# EAGLE schematic GPU (EAGLE 9.4.2)
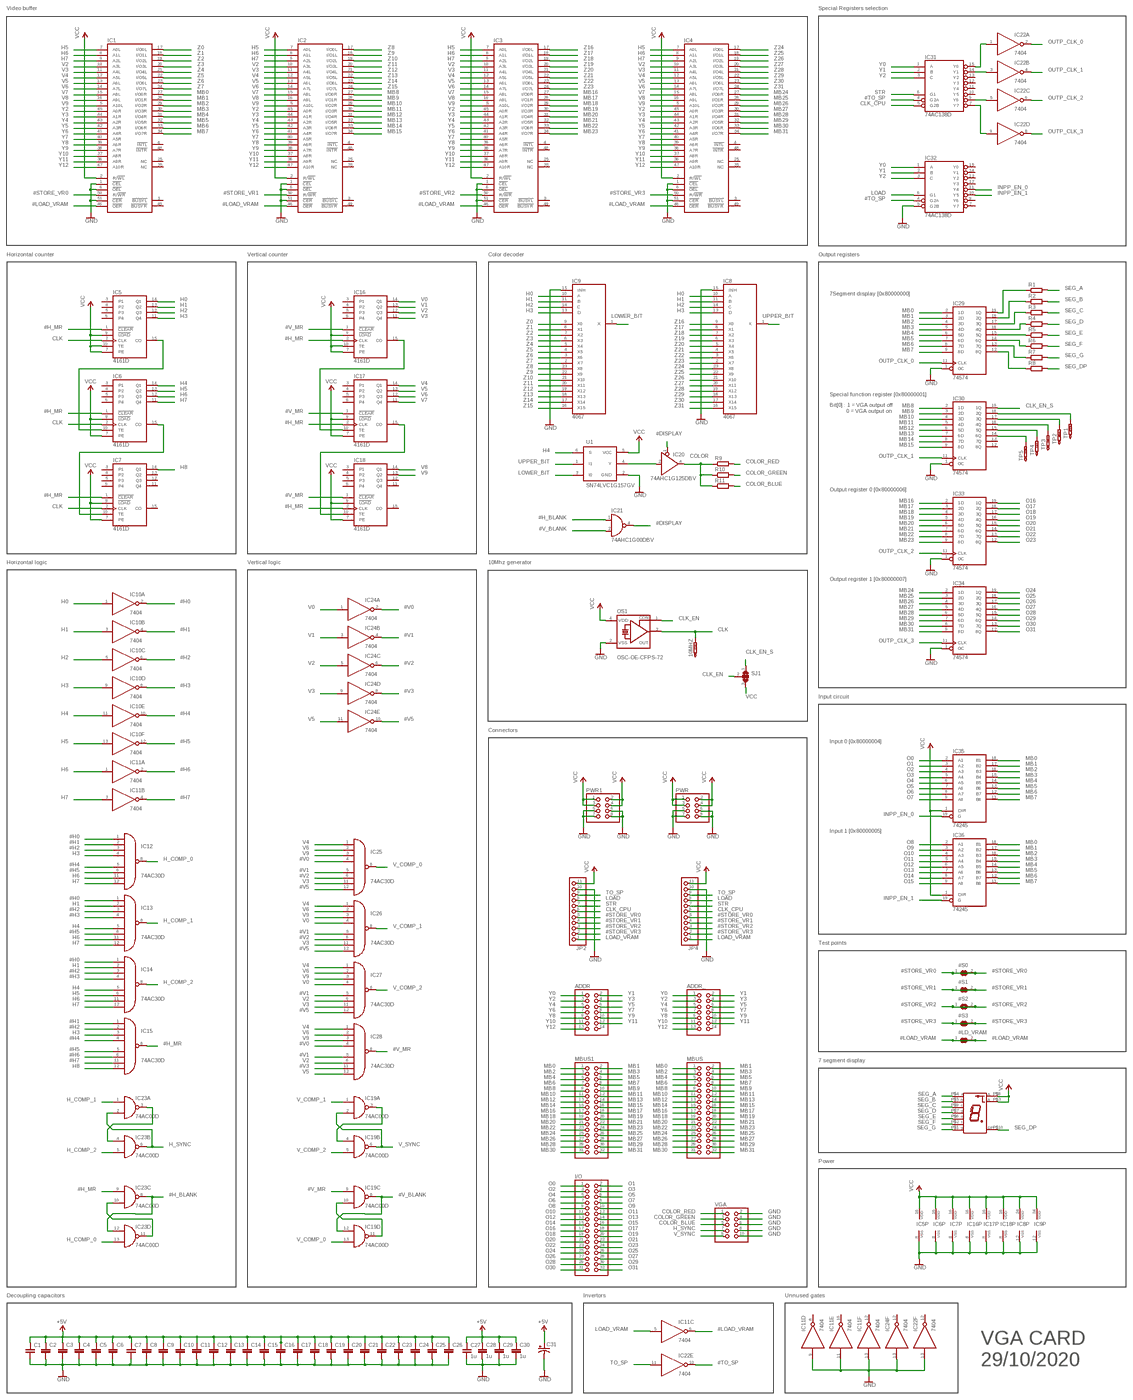
[diagram p0: schematic, sheet 1, overview]
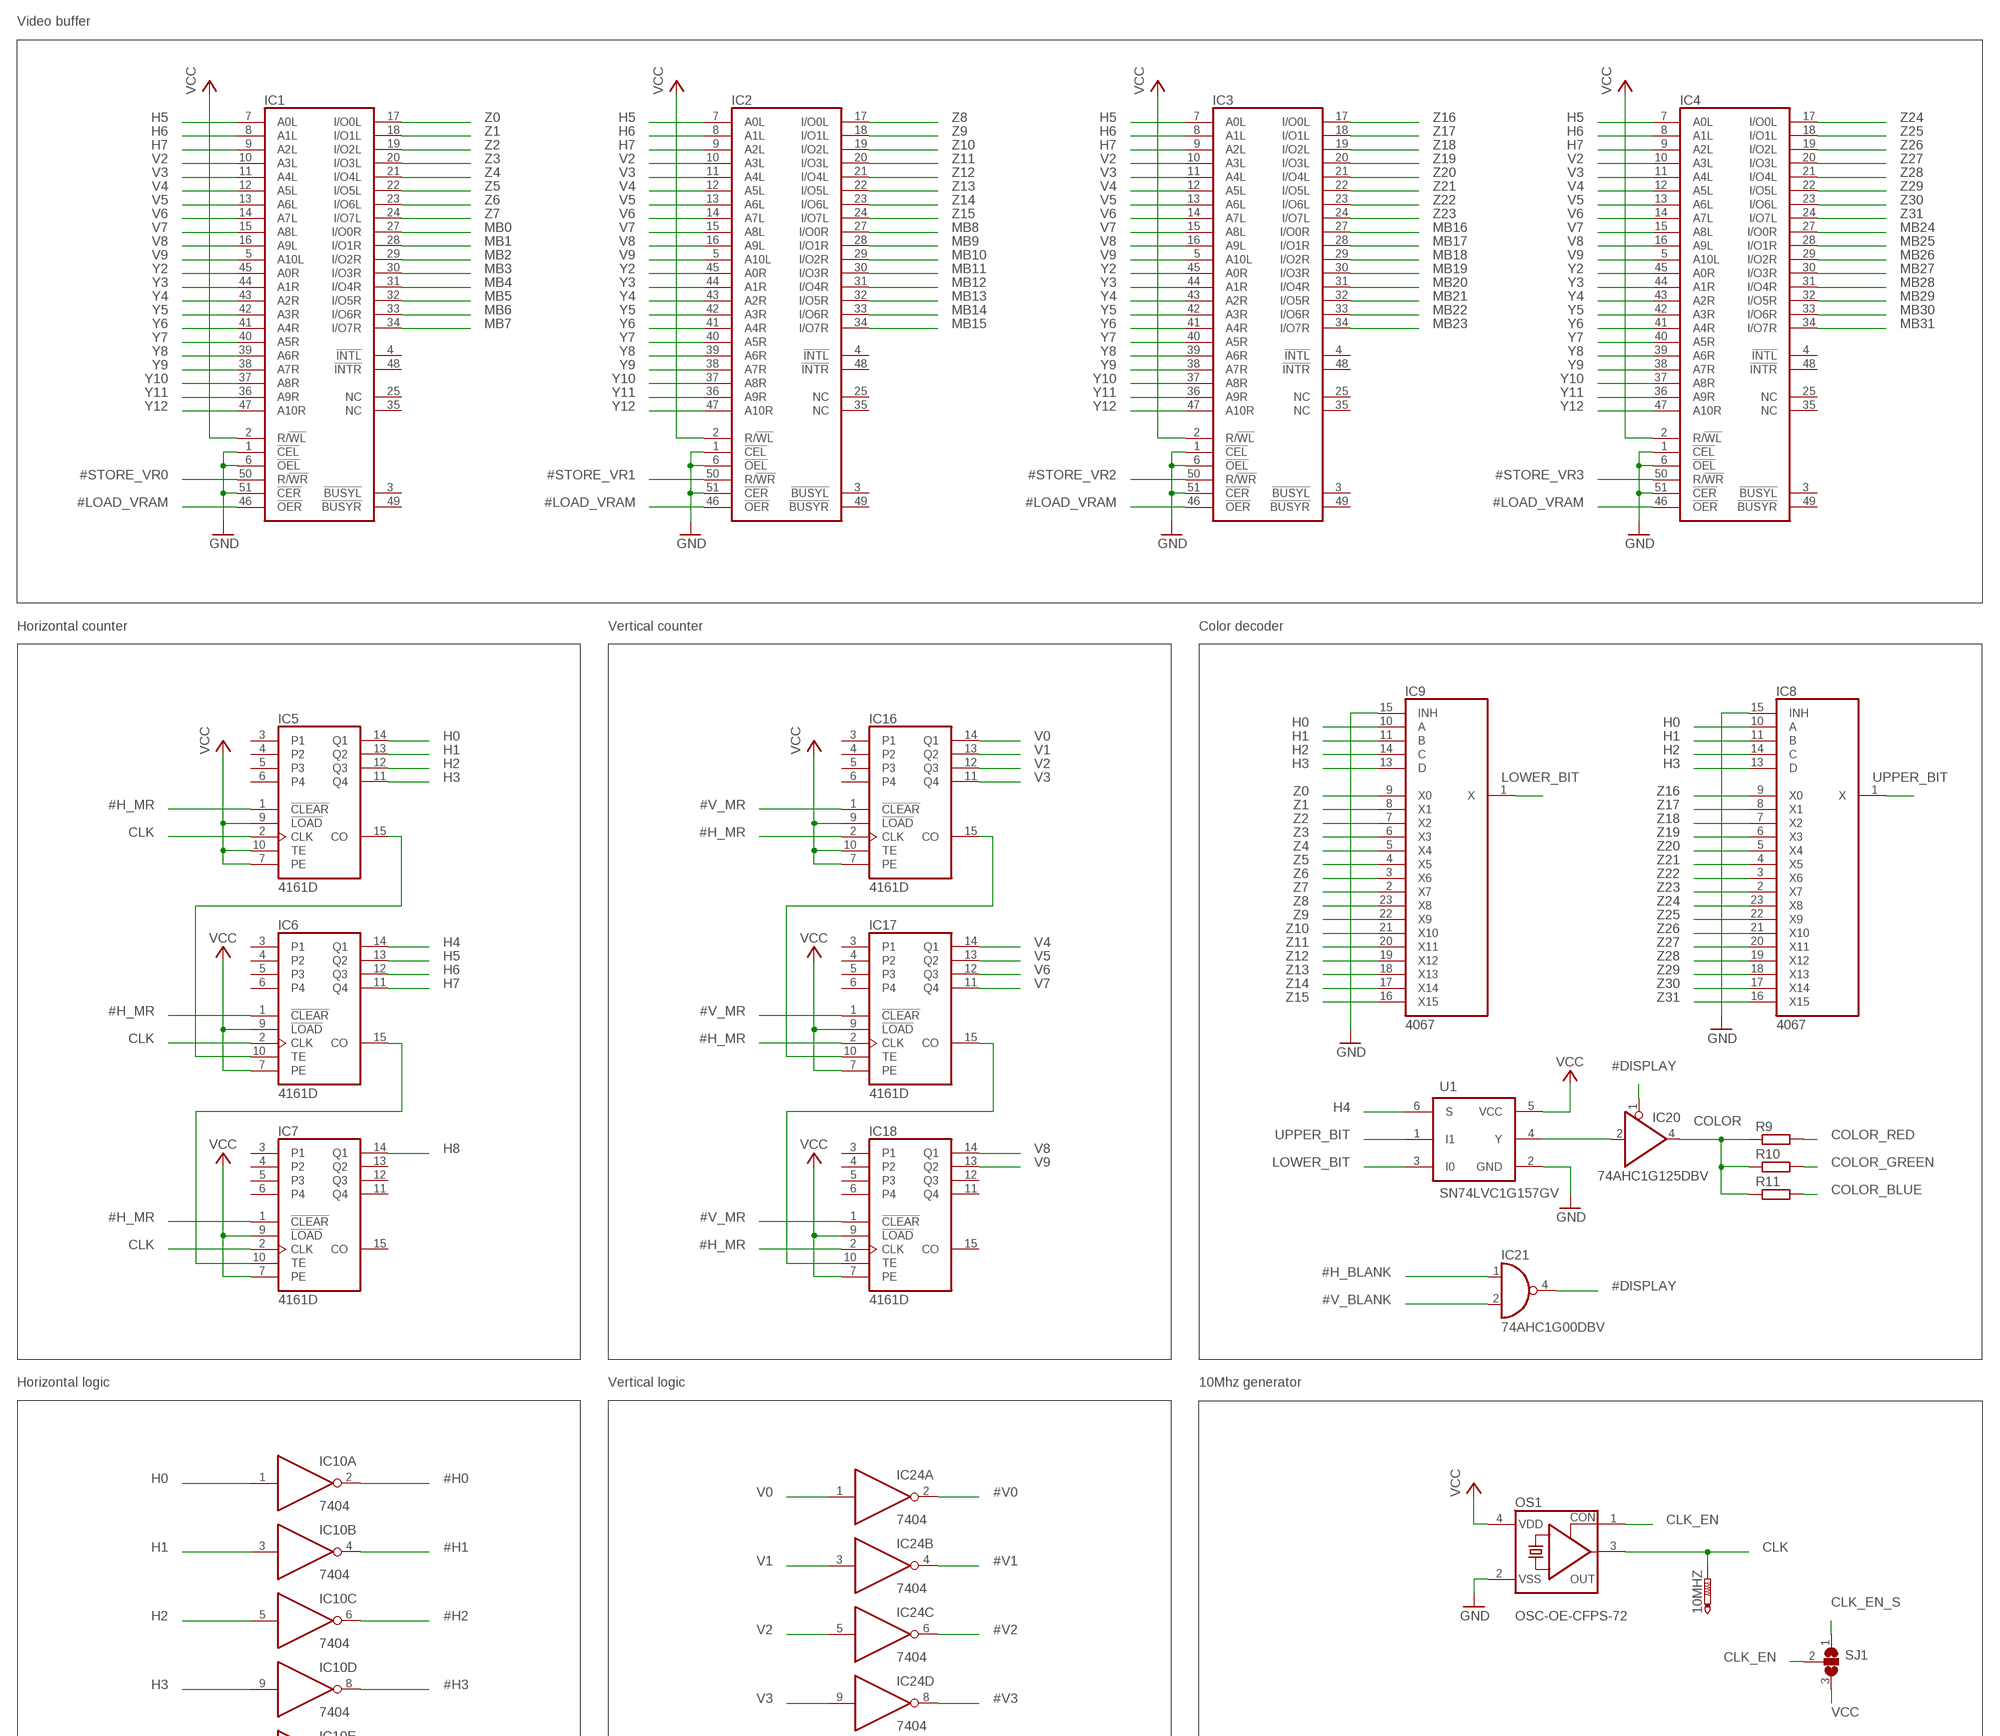
[diagram p1: schematic, sheet 1, part 1 of 4]
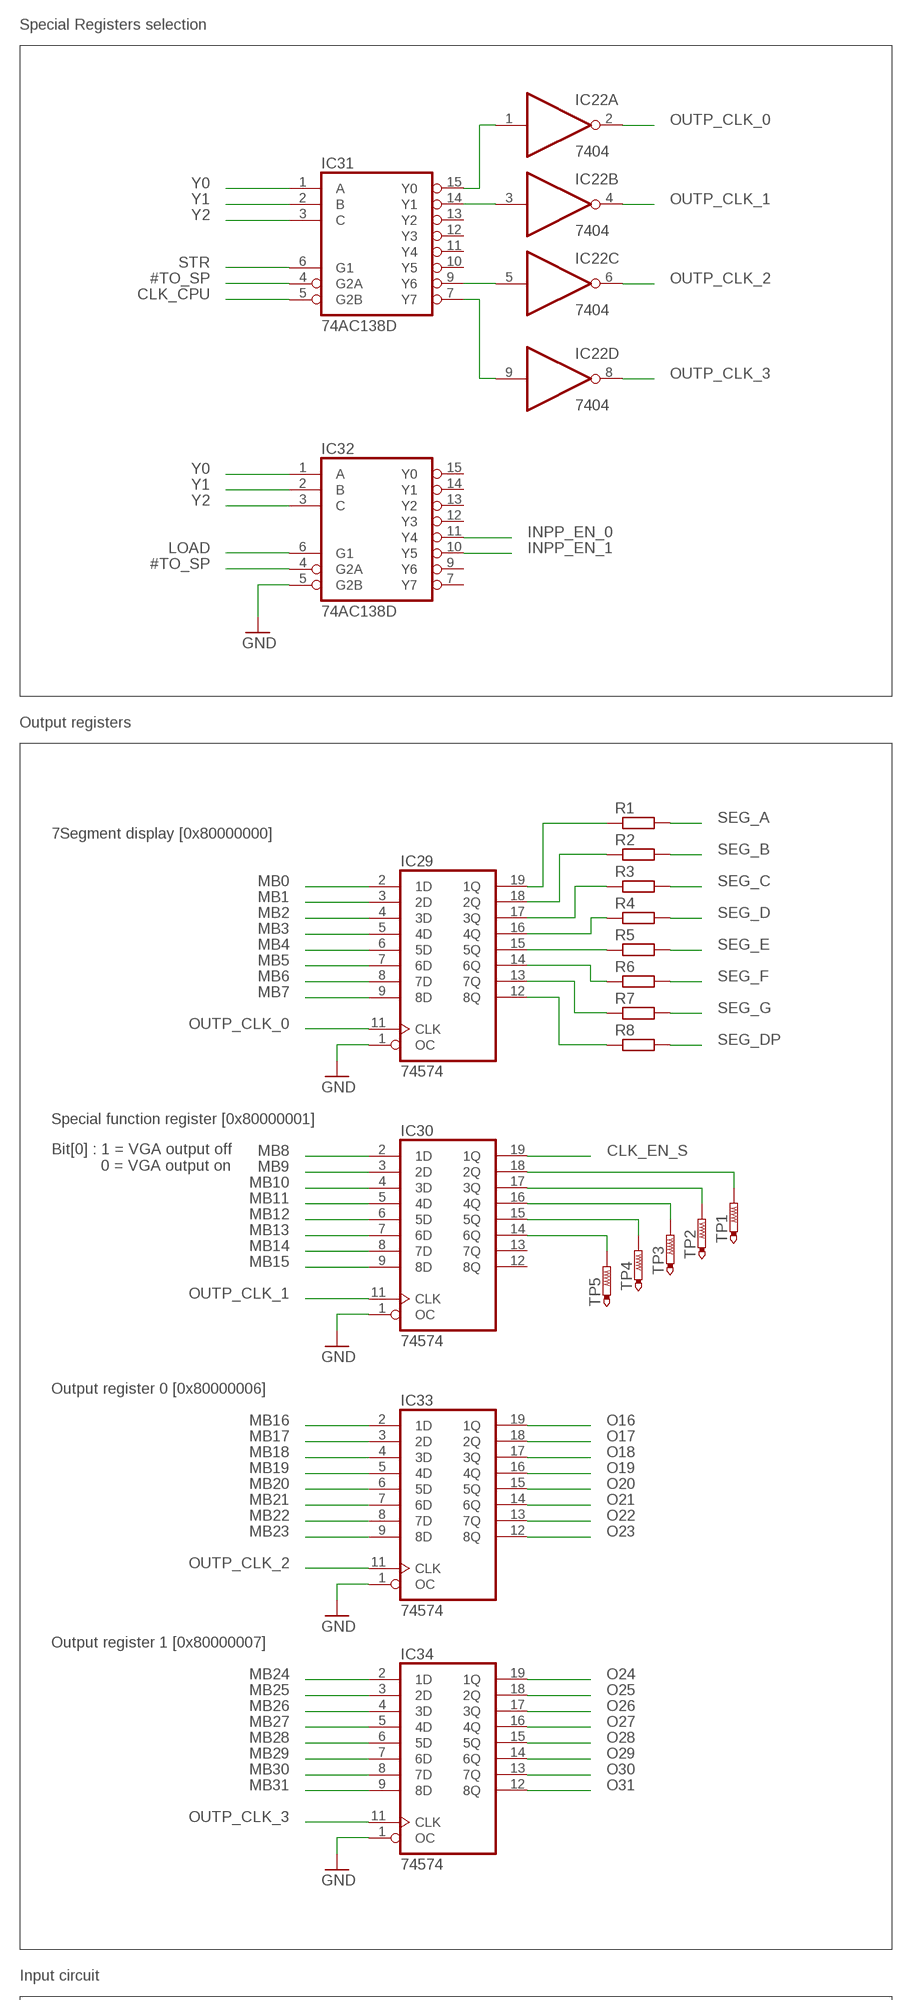
[diagram p2: schematic, sheet 1, part 2 of 4]
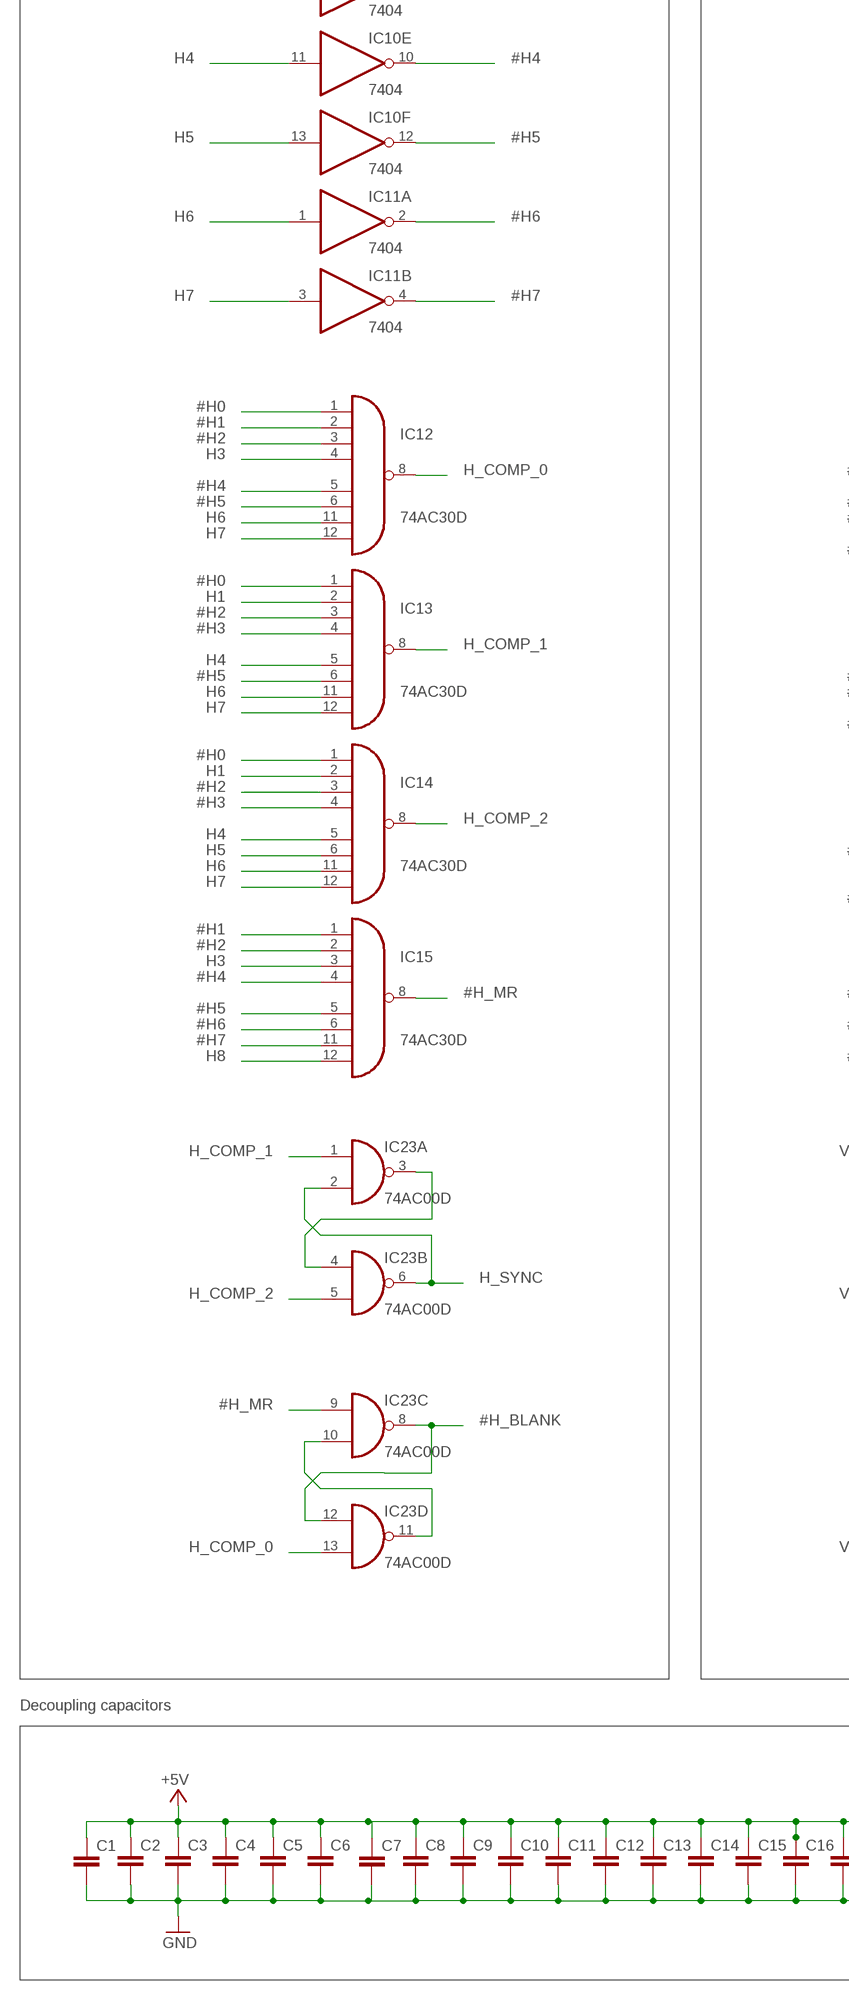
[diagram p3: schematic, sheet 1, part 3 of 4]
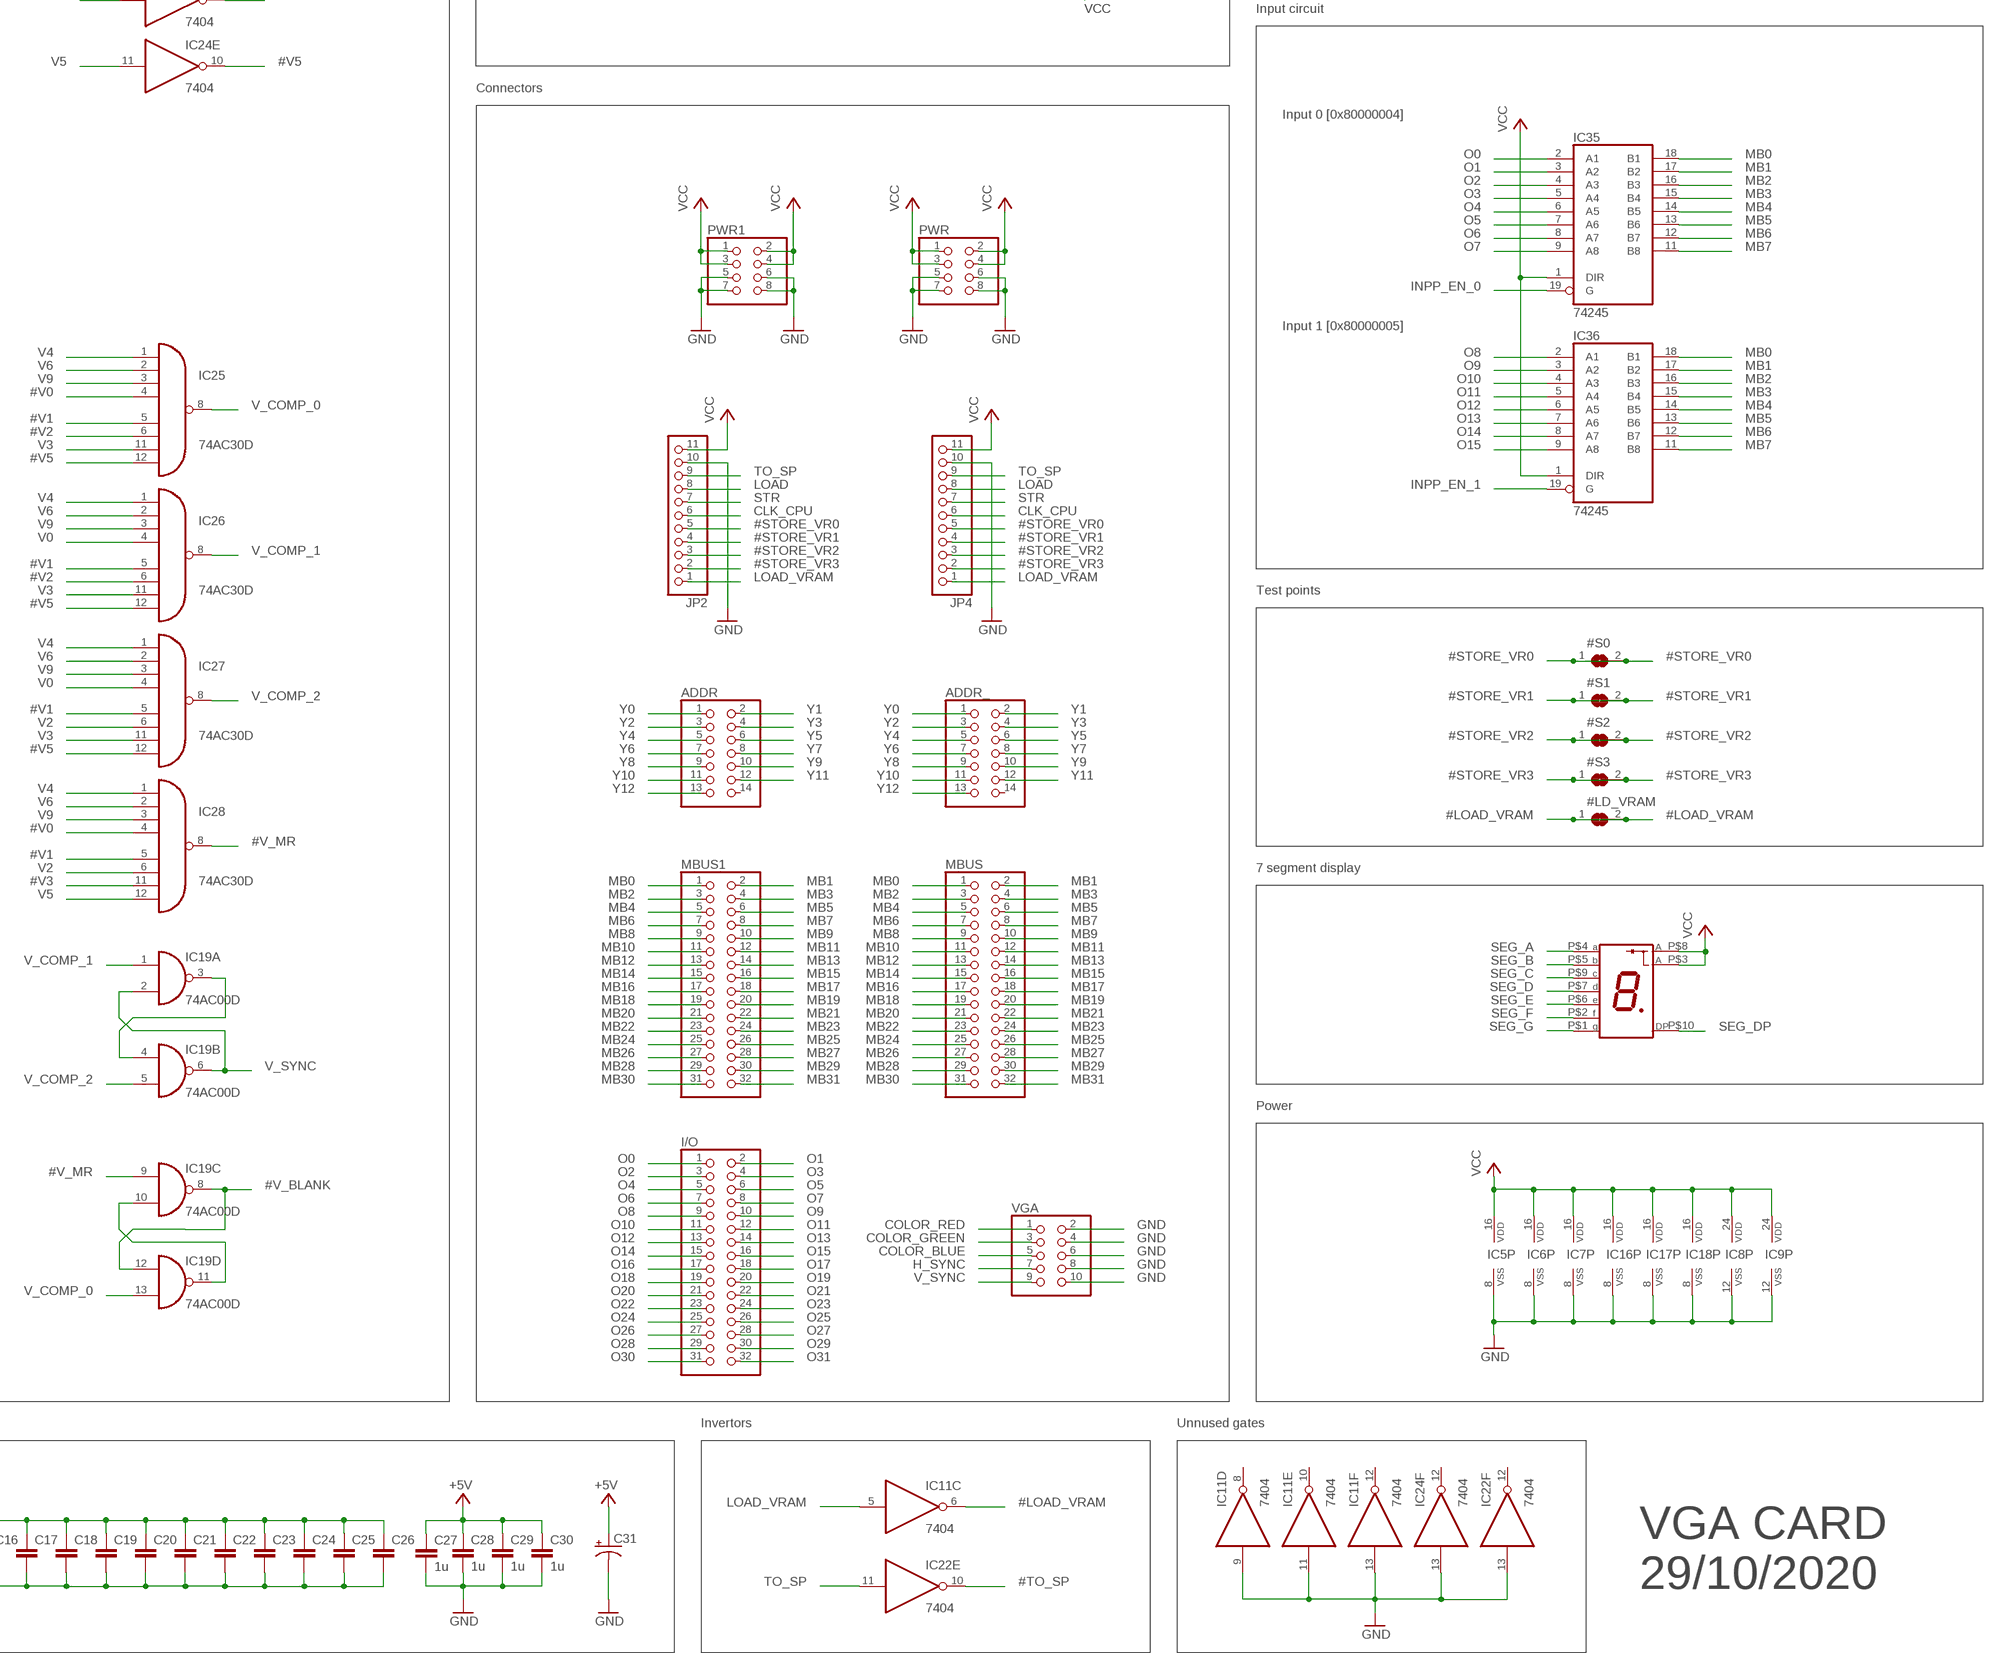
[diagram p4: schematic, sheet 1, part 4 of 4]

## Parts
10MHZ  PTR1B2,54  [B2,54]
#LD_VRAM  SJ  [SJ]
#S0  SJ  [SJ]
#S1  SJ  [SJ]
#S2  SJ  [SJ]
#S3  SJ  [SJ]
ADDR  PINHD-2X7  [2X07]
ADDR_  PINHD-2X7  [2X07]
C1  C-EUC0805  [C0805]
C2  C-EUC0805  [C0805]
C3  C-EUC0805  [C0805]
C4  C-EUC0805  [C0805]
C5  C-EUC0805  [C0805]
C6  C-EUC0805  [C0805]
C7  C-EUC0805  [C0805]
C8  C-EUC0805  [C0805]
C9  C-EUC0805  [C0805]
C10  C-EUC0805  [C0805]
C11  C-EUC0805  [C0805]
C12  C-EUC0805  [C0805]
C13  C-EUC0805  [C0805]
C14  C-EUC0805  [C0805]
C15  C-EUC0805  [C0805]
C16  C-EUC0805  [C0805]
C17  C-EUC0805  [C0805]
C18  C-EUC0805  [C0805]
C19  C-EUC0805  [C0805]
C20  C-EUC0805  [C0805]
C21  C-EUC0805  [C0805]
C22  C-EUC0805  [C0805]
C23  C-EUC0805  [C0805]
C24  C-EUC0805  [C0805]
C25  C-EUC0805  [C0805]
C26  C-EUC0805  [C0805]
C27  1u  C-EUC0805  [C0805]
C28  1u  C-EUC0805  [C0805]
C29  1u  C-EUC0805  [C0805]
C30  1u  C-EUC0805  [C0805]
C31  CAPACITOR-P153CLV-1010  [153CLV-1010]
I/O  PINHD-2X16  [2X16]
IC1  71321L  [L52-1]
IC2  71321L  [L52-1]
IC3  71321L  [L52-1]
IC4  71321L  [L52-1]
IC5  4161D  [SO16]
IC6  4161D  [SO16]
IC7  4161D  [SO16]
IC8  4067  [TSSOP24]
IC9  4067  [TSSOP24]
IC10  7404  [TSSOP14]
IC11  7404  [TSSOP14]
IC12  74AC30D  [SO14]
IC13  74AC30D  [SO14]
IC14  74AC30D  [SO14]
IC15  74AC30D  [SO14]
IC16  4161D  [SO16]
IC17  4161D  [SO16]
IC18  4161D  [SO16]
IC19  74AC00D  [SO14]
IC20  74AHC1G125DBV  [SOT23-5]
IC21  74AHC1G00DBV  [SOT23-5]
IC22  7404  [TSSOP14]
IC23  74AC00D  [SO14]
IC24  7404  [TSSOP14]
IC25  74AC30D  [SO14]
IC26  74AC30D  [SO14]
IC27  74AC30D  [SO14]
IC28  74AC30D  [SO14]
IC29  74574  [TSSOP20]
IC30  74574  [TSSOP20]
IC31  74AC138D  [SO16]
IC32  74AC138D  [SO16]
IC33  74574  [TSSOP20]
IC34  74574  [TSSOP20]
IC35  74245  [TSSOP20]
IC36  74245  [TSSOP20]
JP2  PINHD-1X11  [1X11]
JP4  PINHD-1X11  [1X11]
MBUS  PINHD-2X16  [2X16]
MBUS1  PINHD-2X16  [2X16]
OS1  OSC-OE-CFPS-72  [7.2X5.2-4-PAD]
PWR  PINHD-2X4  [2X04]
PWR1  PINHD-2X4  [2X04]
R1  R-EU_R0805  [R0805]
R2  R-EU_R0805  [R0805]
R3  R-EU_R0805  [R0805]
R4  R-EU_R0805  [R0805]
R5  R-EU_R0805  [R0805]
R6  R-EU_R0805  [R0805]
R7  R-EU_R0805  [R0805]
R8  R-EU_R0805  [R0805]
R9  R-EU_R0805  [R0805]
R10  R-EU_R0805  [R0805]
R11  R-EU_R0805  [R0805]
SJ1  SJ2W  [SJ_2]
TP1  PTR1B1,27  [B1,27]
TP2  PTR1B1,27  [B1,27]
TP3  PTR1B1,27  [B1,27]
TP4  PTR1B1,27  [B1,27]
TP5  PTR1B1,27  [B1,27]
U1  SN74LVC1G157GV  [SOT457]
U$1  OPS-S5621YG  [OPS-S5621YG]
VGA  PINHD-2X5  [2X05]

## Nets
#DISPLAY: IC20.1(OE) IC21.4(O)
#H0: IC10.2(A:O) IC12.1(I0) IC13.1(I0) IC14.1(I0)
#H1: IC10.4(B:O) IC12.2(I1) IC15.1(I0)
#H2: IC10.6(C:O) IC12.3(I2) IC13.3(I2) IC14.3(I2) IC15.2(I1)
#H3: IC10.8(D:O) IC13.4(I3) IC14.4(I3)
#H4: IC10.10(E:O) IC12.5(I4) IC15.4(I3)
#H5: IC10.12(F:O) IC12.6(I5) IC13.6(I5) IC15.5(I4)
#H6: IC11.2(A:O) IC15.6(I5)
#H7: IC11.4(B:O) IC15.11(I6)
#H_BLANK: IC21.1(I0) IC23.8(C:O) IC23.12(D:I0)
#H_MR: IC5.1(!CLEAR) IC6.1(!CLEAR) IC7.1(!CLEAR) IC15.8(O) IC16.2(CLK) IC17.2(CLK) IC18.2(CLK) IC23.9(C:I0)
#LOAD_VRAM: #LD_VRAM.1 #LD_VRAM.2 IC1.46(!OER) IC2.46(!OER) IC3.46(!OER) IC4.46(!OER) IC11.6(C:O)
#STORE_VR0: #S0.1 #S0.2 IC1.50(R/!WR) JP2.5 JP4.5
#STORE_VR1: #S1.1 #S1.2 IC2.50(R/!WR) JP2.4 JP4.4
#STORE_VR2: #S2.1 #S2.2 IC3.50(R/!WR) JP2.3 JP4.3
#STORE_VR3: #S3.1 #S3.2 IC4.50(R/!WR) JP2.2 JP4.2
#TO_SP: IC22.10(E:O) IC31.4(G2A) IC32.4(G2A)
#V0: IC24.2(A:O) IC25.4(I3) IC28.4(I3)
#V1: IC24.4(B:O) IC25.5(I4) IC26.5(I4) IC27.5(I4) IC28.5(I4)
#V2: IC24.6(C:O) IC25.6(I5) IC26.6(I5)
#V3: IC24.8(D:O) IC28.11(I6)
#V5: IC24.10(E:O) IC25.12(I7) IC26.12(I7) IC27.12(I7)
#V_BLANK: IC19.8(C:O) IC19.12(D:I0) IC21.2(I1)
#V_MR: IC16.1(!CLEAR) IC17.1(!CLEAR) IC18.1(!CLEAR) IC19.9(C:I0) IC28.8(O)
CLK: 10MHZ.TP IC5.2(CLK) IC6.2(CLK) IC7.2(CLK) OS1.3(OUT)
CLK_CPU: IC31.5(G2B) JP2.6 JP4.6
CLK_EN: OS1.1(CON) SJ1.2
CLK_EN_S: IC30.19(1Q) SJ1.1
COLOR: IC20.4(O) R9.1 R10.1 R11.1
COLOR_BLUE: R11.2 VGA.5
COLOR_GREEN: R10.2 VGA.3
COLOR_RED: R9.2 VGA.1
GND: C1.2 C2.2 C3.2 C4.2 C5.2 C6.2 C7.2 C8.2 C9.2 C10.2 C11.2 C12.2 C13.2 C14.2 C15.2 C16.2 C17.2 C18.2 C19.2 C20.2 C21.2 C22.2 C23.2 C24.2 C25.2 C26.2 C27.2 C28.2 C29.2 C30.2 C31.- IC1.1(!CEL) IC1.6(!OEL) IC1.51(!CER) IC2.1(!CEL) IC2.6(!OEL) IC2.51(!CER) IC3.1(!CEL) IC3.6(!OEL) IC3.51(!CER) IC4.1(!CEL) IC4.6(!OEL) IC4.51(!CER) IC5.8(VSS) IC6.8(VSS) IC7.8(VSS) IC8.12(VSS) IC8.15(INH) IC9.12(VSS) IC9.15(INH) IC11.9(D:I) IC11.11(E:I) IC11.13(F:I) IC16.8(VSS) IC17.8(VSS) IC18.8(VSS) IC22.13(F:I) IC24.13(F:I) IC29.1(OC) IC30.1(OC) IC32.5(G2B) IC33.1(OC) IC34.1(OC) JP2.10 JP4.10 OS1.2(VSS) PWR1.5 PWR1.6 PWR1.7 PWR1.8 PWR.5 PWR.6 PWR.7 PWR.8 U1.2(GND) VGA.2 VGA.4 VGA.6 VGA.8 VGA.10
H0: IC5.14(Q1) IC8.10(A) IC9.10(A) IC10.1(A:I)
H1: IC5.13(Q2) IC8.11(B) IC9.11(B) IC10.3(B:I) IC13.2(I1) IC14.2(I1)
H2: IC5.12(Q3) IC8.14(C) IC9.14(C) IC10.5(C:I)
H3: IC5.11(Q4) IC8.13(D) IC9.13(D) IC10.9(D:I) IC12.4(I3) IC15.3(I2)
H4: IC6.14(Q1) IC10.11(E:I) IC13.5(I4) IC14.5(I4) U1.6(S)
H5: IC1.7(A0L) IC2.7(A0L) IC3.7(A0L) IC4.7(A0L) IC6.13(Q2) IC10.13(F:I) IC14.6(I5)
H6: IC1.8(A1L) IC2.8(A1L) IC3.8(A1L) IC4.8(A1L) IC6.12(Q3) IC11.1(A:I) IC12.11(I6) IC13.11(I6) IC14.11(I6)
H7: IC1.9(A2L) IC2.9(A2L) IC3.9(A2L) IC4.9(A2L) IC6.11(Q4) IC11.3(B:I) IC12.12(I7) IC13.12(I7) IC14.12(I7)
H8: IC7.14(Q1) IC15.12(I7)
H_COMP_0: IC12.8(O) IC23.13(D:I1)
H_COMP_1: IC13.8(O) IC23.1(A:I0)
H_COMP_2: IC14.8(O) IC23.5(B:I1)
H_SYNC: IC23.2(A:I1) IC23.6(B:O) VGA.7
H_SYNC1: IC23.10(C:I1) IC23.11(D:O)
H_SYNC2: IC19.10(C:I1) IC19.11(D:O)
INPP_EN_0: IC32.11(Y4) IC35.19(G)
INPP_EN_1: IC32.10(Y5) IC36.19(G)
LOAD: IC32.6(G1) JP2.8 JP4.8
LOAD_VRAM: IC11.5(C:I) JP2.1 JP4.1
LOWER_BIT: IC9.1(X) U1.3(I0)
MB0: IC1.27(I/O0R) IC29.2(1D) IC35.18(B1) IC36.18(B1) MBUS1.1 MBUS.1
MB1: IC1.28(I/O1R) IC29.3(2D) IC35.17(B2) IC36.17(B2) MBUS1.2 MBUS.2
MB2: IC1.29(I/O2R) IC29.4(3D) IC35.16(B3) IC36.16(B3) MBUS1.3 MBUS.3
MB3: IC1.30(I/O3R) IC29.5(4D) IC35.15(B4) IC36.15(B4) MBUS1.4 MBUS.4
MB4: IC1.31(I/O4R) IC29.6(5D) IC35.14(B5) IC36.14(B5) MBUS1.5 MBUS.5
MB5: IC1.32(I/O5R) IC29.7(6D) IC35.13(B6) IC36.13(B6) MBUS1.6 MBUS.6
MB6: IC1.33(I/O6R) IC29.8(7D) IC35.12(B7) IC36.12(B7) MBUS1.7 MBUS.7
MB7: IC1.34(I/O7R) IC29.9(8D) IC35.11(B8) IC36.11(B8) MBUS1.8 MBUS.8
MB8: IC2.27(I/O0R) IC30.2(1D) MBUS1.9 MBUS.9
MB9: IC2.28(I/O1R) IC30.3(2D) MBUS1.10 MBUS.10
MB10: IC2.29(I/O2R) IC30.4(3D) MBUS1.11 MBUS.11
MB11: IC2.30(I/O3R) IC30.5(4D) MBUS1.12 MBUS.12
MB12: IC2.31(I/O4R) IC30.6(5D) MBUS1.13 MBUS.13
MB13: IC2.32(I/O5R) IC30.7(6D) MBUS1.14 MBUS.14
MB14: IC2.33(I/O6R) IC30.8(7D) MBUS1.15 MBUS.15
MB15: IC2.34(I/O7R) IC30.9(8D) MBUS1.16 MBUS.16
MB16: IC3.27(I/O0R) IC33.2(1D) MBUS1.17 MBUS.17
MB17: IC3.28(I/O1R) IC33.3(2D) MBUS1.18 MBUS.18
MB18: IC3.29(I/O2R) IC33.4(3D) MBUS1.19 MBUS.19
MB19: IC3.30(I/O3R) IC33.5(4D) MBUS1.20 MBUS.20
MB20: IC3.31(I/O4R) IC33.6(5D) MBUS1.21 MBUS.21
MB21: IC3.32(I/O5R) IC33.7(6D) MBUS1.22 MBUS.22
MB22: IC3.33(I/O6R) IC33.8(7D) MBUS1.23 MBUS.23
MB23: IC3.34(I/O7R) IC33.9(8D) MBUS1.24 MBUS.24
MB24: IC4.27(I/O0R) IC34.2(1D) MBUS1.25 MBUS.25
MB25: IC4.28(I/O1R) IC34.3(2D) MBUS1.26 MBUS.26
MB26: IC4.29(I/O2R) IC34.4(3D) MBUS1.27 MBUS.27
MB27: IC4.30(I/O3R) IC34.5(4D) MBUS1.28 MBUS.28
MB28: IC4.31(I/O4R) IC34.6(5D) MBUS1.29 MBUS.29
MB29: IC4.32(I/O5R) IC34.7(6D) MBUS1.30 MBUS.30
MB30: IC4.33(I/O6R) IC34.8(7D) MBUS1.31 MBUS.31
MB31: IC4.34(I/O7R) IC34.9(8D) MBUS1.32 MBUS.32
N$1: IC23.3(A:O) IC23.4(B:I0)
N$2: IC5.15(CO) IC6.10(TE)
N$3: IC6.15(CO) IC7.10(TE)
N$4: IC16.15(CO) IC17.10(TE)
N$5: IC17.15(CO) IC18.10(TE)
N$6: IC19.3(A:O) IC19.4(B:I0)
N$7: IC20.2(I) U1.4(Y)
N$8: IC22.1(A:I) IC31.15(Y0)
N$9: IC30.18(2Q) TP1.TP
N$10: IC29.19(1Q) R1.1
N$11: IC22.9(D:I) IC31.7(Y7)
N$12: IC29.18(2Q) R2.1
N$13: IC29.17(3Q) R3.1
N$14: IC29.16(4Q) R4.1
N$15: IC29.15(5Q) R5.1
N$16: IC29.14(6Q) R6.1
N$17: IC22.5(C:I) IC31.9(Y6)
N$18: IC29.13(7Q) R7.1
N$19: IC29.12(8Q) R8.1
N$20: IC22.3(B:I) IC31.14(Y1)
N$21: IC30.17(3Q) TP2.TP
N$22: IC30.16(4Q) TP3.TP
N$23: IC30.15(5Q) TP4.TP
N$24: IC30.14(6Q) TP5.TP
O0: I/O.1 IC35.2(A1)
O1: I/O.2 IC35.3(A2)
O2: I/O.3 IC35.4(A3)
O3: I/O.4 IC35.5(A4)
O4: I/O.5 IC35.6(A5)
O5: I/O.6 IC35.7(A6)
O6: I/O.7 IC35.8(A7)
O7: I/O.8 IC35.9(A8)
O8: I/O.9 IC36.2(A1)
O9: I/O.10 IC36.3(A2)
O10: I/O.11 IC36.4(A3)
O11: I/O.12 IC36.5(A4)
O12: I/O.13 IC36.6(A5)
O13: I/O.14 IC36.7(A6)
O14: I/O.15 IC36.8(A7)
O15: I/O.16 IC36.9(A8)
O16: I/O.17 IC33.19(1Q)
O17: I/O.18 IC33.18(2Q)
O18: I/O.19 IC33.17(3Q)
O19: I/O.20 IC33.16(4Q)
O20: I/O.21 IC33.15(5Q)
O21: I/O.22 IC33.14(6Q)
O22: I/O.23 IC33.13(7Q)
O23: I/O.24 IC33.12(8Q)
O24: I/O.25 IC34.19(1Q)
O25: I/O.26 IC34.18(2Q)
O26: I/O.27 IC34.17(3Q)
O27: I/O.28 IC34.16(4Q)
O28: I/O.29 IC34.15(5Q)
O29: I/O.30 IC34.14(6Q)
O30: I/O.31 IC34.13(7Q)
O31: I/O.32 IC34.12(8Q)
OUTP_CLK_0: IC22.2(A:O) IC29.11(CLK)
OUTP_CLK_1: IC22.4(B:O) IC30.11(CLK)
OUTP_CLK_2: IC22.6(C:O) IC33.11(CLK)
OUTP_CLK_3: IC22.8(D:O) IC34.11(CLK)
SEG_A: R1.2 U$1.P$4(A)
SEG_B: R2.2 U$1.P$5(B)
SEG_C: R3.2 U$1.P$9(C)
SEG_D: R4.2 U$1.P$7(D)
SEG_DP: R8.2 U$1.P$10(DP)
SEG_E: R5.2 U$1.P$6(E)
SEG_F: R6.2 U$1.P$2(F)
SEG_G: R7.2 U$1.P$1(G)
STR: IC31.6(G1) JP2.7 JP4.7
TO_SP: IC22.11(E:I) JP2.9 JP4.9
UPPER_BIT: IC8.1(X) U1.1(I1)
V0: IC16.14(Q1) IC24.1(A:I) IC26.4(I3) IC27.4(I3)
V1: IC16.13(Q2) IC24.3(B:I)
V2: IC1.10(A3L) IC2.10(A3L) IC3.10(A3L) IC4.10(A3L) IC16.12(Q3) IC24.5(C:I) IC27.6(I5) IC28.6(I5)
V3: IC1.11(A4L) IC2.11(A4L) IC3.11(A4L) IC4.11(A4L) IC16.11(Q4) IC24.9(D:I) IC25.11(I6) IC26.11(I6) IC27.11(I6)
V4: IC1.12(A5L) IC2.12(A5L) IC3.12(A5L) IC4.12(A5L) IC17.14(Q1) IC25.1(I0) IC26.1(I0) IC27.1(I0) IC28.1(I0)
V5: IC1.13(A6L) IC2.13(A6L) IC3.13(A6L) IC4.13(A6L) IC17.13(Q2) IC24.11(E:I) IC28.12(I7)
V6: IC1.14(A7L) IC2.14(A7L) IC3.14(A7L) IC4.14(A7L) IC17.12(Q3) IC25.2(I1) IC26.2(I1) IC27.2(I1) IC28.2(I1)
V7: IC1.15(A8L) IC2.15(A8L) IC3.15(A8L) IC4.15(A8L) IC17.11(Q4)
V8: IC1.16(A9L) IC2.16(A9L) IC3.16(A9L) IC4.16(A9L) IC18.14(Q1)
V9: IC1.5(A10L) IC2.5(A10L) IC3.5(A10L) IC4.5(A10L) IC18.13(Q2) IC25.3(I2) IC26.3(I2) IC27.3(I2) IC28.3(I2)
V_COMP_0: IC19.13(D:I1) IC25.8(O)
V_COMP_1: IC19.1(A:I0) IC26.8(O)
V_COMP_2: IC19.5(B:I1) IC27.8(O)
V_SYNC: IC19.2(A:I1) IC19.6(B:O) VGA.9
VCC: C1.1 C2.1 C3.1 C4.1 C5.1 C6.1 C7.1 C8.1 C9.1 C10.1 C11.1 C12.1 C13.1 C14.1 C15.1 C16.1 C17.1 C18.1 C19.1 C20.1 C21.1 C22.1 C23.1 C24.1 C25.1 C26.1 C27.1 C28.1 C29.1 C30.1 C31.+ IC1.2(R/!WL) IC2.2(R/!WL) IC3.2(R/!WL) IC4.2(R/!WL) IC5.7(PE) IC5.9(!LOAD) IC5.10(TE) IC5.16(VDD) IC6.7(PE) IC6.9(!LOAD) IC6.16(VDD) IC7.7(PE) IC7.9(!LOAD) IC7.16(VDD) IC8.24(VDD) IC9.24(VDD) IC16.7(PE) IC16.9(!LOAD) IC16.10(TE) IC16.16(VDD) IC17.7(PE) IC17.9(!LOAD) IC17.16(VDD) IC18.7(PE) IC18.9(!LOAD) IC18.16(VDD) IC35.1(DIR) IC36.1(DIR) JP2.11 JP4.11 OS1.4(VDD) PWR1.1 PWR1.2 PWR1.3 PWR1.4 PWR.1 PWR.2 PWR.3 PWR.4 SJ1.3 U1.5(VCC) U$1.P$3(A) U$1.P$8(A) ; supply symbol labelled +5V
Y0: ADDR.1 ADDR_.1 IC31.1(A) IC32.1(A)
Y1: ADDR.2 ADDR_.2 IC31.2(B) IC32.2(B)
Y2: ADDR.3 ADDR_.3 IC1.45(A0R) IC2.45(A0R) IC3.45(A0R) IC4.45(A0R) IC31.3(C) IC32.3(C)
Y3: ADDR.4 ADDR_.4 IC1.44(A1R) IC2.44(A1R) IC3.44(A1R) IC4.44(A1R)
Y4: ADDR.5 ADDR_.5 IC1.43(A2R) IC2.43(A2R) IC3.43(A2R) IC4.43(A2R)
Y5: ADDR.6 ADDR_.6 IC1.42(A3R) IC2.42(A3R) IC3.42(A3R) IC4.42(A3R)
Y6: ADDR.7 ADDR_.7 IC1.41(A4R) IC2.41(A4R) IC3.41(A4R) IC4.41(A4R)
Y7: ADDR.8 ADDR_.8 IC1.40(A5R) IC2.40(A5R) IC3.40(A5R) IC4.40(A5R)
Y8: ADDR.9 ADDR_.9 IC1.39(A6R) IC2.39(A6R) IC3.39(A6R) IC4.39(A6R)
Y9: ADDR.10 ADDR_.10 IC1.38(A7R) IC2.38(A7R) IC3.38(A7R) IC4.38(A7R)
Y10: ADDR.11 ADDR_.11 IC1.37(A8R) IC2.37(A8R) IC3.37(A8R) IC4.37(A8R)
Y11: ADDR.12 ADDR_.12 IC1.36(A9R) IC2.36(A9R) IC3.36(A9R) IC4.36(A9R)
Y12: ADDR.13 ADDR_.13 IC1.47(A10R) IC2.47(A10R) IC3.47(A10R) IC4.47(A10R)
Z0: IC1.17(I/O0L) IC9.9(X0)
Z1: IC1.18(I/O1L) IC9.8(X1)
Z2: IC1.19(I/O2L) IC9.7(X2)
Z3: IC1.20(I/O3L) IC9.6(X3)
Z4: IC1.21(I/O4L) IC9.5(X4)
Z5: IC1.22(I/O5L) IC9.4(X5)
Z6: IC1.23(I/O6L) IC9.3(X6)
Z7: IC1.24(I/O7L) IC9.2(X7)
Z8: IC2.17(I/O0L) IC9.23(X8)
Z9: IC2.18(I/O1L) IC9.22(X9)
Z10: IC2.19(I/O2L) IC9.21(X10)
Z11: IC2.20(I/O3L) IC9.20(X11)
Z12: IC2.21(I/O4L) IC9.19(X12)
Z13: IC2.22(I/O5L) IC9.18(X13)
Z14: IC2.23(I/O6L) IC9.17(X14)
Z15: IC2.24(I/O7L) IC9.16(X15)
Z16: IC3.17(I/O0L) IC8.9(X0)
Z17: IC3.18(I/O1L) IC8.8(X1)
Z18: IC3.19(I/O2L) IC8.7(X2)
Z19: IC3.20(I/O3L) IC8.6(X3)
Z20: IC3.21(I/O4L) IC8.5(X4)
Z21: IC3.22(I/O5L) IC8.4(X5)
Z22: IC3.23(I/O6L) IC8.3(X6)
Z23: IC3.24(I/O7L) IC8.2(X7)
Z24: IC4.17(I/O0L) IC8.23(X8)
Z25: IC4.18(I/O1L) IC8.22(X9)
Z26: IC4.19(I/O2L) IC8.21(X10)
Z27: IC4.20(I/O3L) IC8.20(X11)
Z28: IC4.21(I/O4L) IC8.19(X12)
Z29: IC4.22(I/O5L) IC8.18(X13)
Z30: IC4.23(I/O6L) IC8.17(X14)
Z31: IC4.24(I/O7L) IC8.16(X15)
Unconnected: ADDR.14 ADDR_.14 IC1.3(!BUSYL) IC1.4(!INTL) IC1.25(NC) IC1.35(NC) IC1.48(!INTR) IC1.49(!BUSYR) IC2.3(!BUSYL) IC2.4(!INTL) IC2.25(NC) IC2.35(NC) IC2.48(!INTR) IC2.49(!BUSYR) IC3.3(!BUSYL) IC3.4(!INTL) IC3.25(NC) IC3.35(NC) IC3.48(!INTR) IC3.49(!BUSYR) IC4.3(!BUSYL) IC4.4(!INTL) IC4.25(NC) IC4.35(NC) IC4.48(!INTR) IC4.49(!BUSYR) IC5.3(P1) IC5.4(P2) IC5.5(P3) IC5.6(P4) IC6.3(P1) IC6.4(P2) IC6.5(P3) IC6.6(P4) IC7.3(P1) IC7.4(P2) IC7.5(P3) IC7.6(P4) IC7.11(Q4) IC7.12(Q3) IC7.13(Q2) IC7.15(CO) IC11.8(D:O) IC11.10(E:O) IC11.12(F:O) IC16.3(P1) IC16.4(P2) IC16.5(P3) IC16.6(P4) IC17.3(P1) IC17.4(P2) IC17.5(P3) IC17.6(P4) IC18.3(P1) IC18.4(P2) IC18.5(P3) IC18.6(P4) IC18.11(Q4) IC18.12(Q3) IC18.15(CO) IC22.12(F:O) IC24.12(F:O) IC30.12(8Q) IC30.13(7Q) IC31.10(Y5) IC31.11(Y4) IC31.12(Y3) IC31.13(Y2) IC32.7(Y7) IC32.9(Y6) IC32.12(Y3) IC32.13(Y2) IC32.14(Y1) IC32.15(Y0)

## Notes on the sheet
- Video buffer | Special Registers selection
- Horizontal counter | Vertical counter | Color decoder | Output registers
- 7Segment display [0x80000000]
- Special function register [0x80000001]
- Bit[0] : 1 = VGA output off
             0 = VGA output on
- Output register 0 [0x80000006]
- Horizontal logic | Vertical logic | 10Mhz generator
- Output register 1 [0x80000007]
- Input circuit
- Connectors
- Input 0 [0x80000004]
- Input 1 [0x80000005]
- Test points
- 7 segment display
- Power
- Decoupling capacitors | Invertors | Unnused gates
- VGA CARD
  29/10/2020

## Power pins joined to a net without a drawn wire
GND: IC1.26(GND) IC2.26(GND) IC3.26(GND) IC4.26(GND) IC10.7(P:GND) IC11.7(P:GND) IC12.7(GND) IC13.7(GND) IC14.7(GND) IC15.7(GND) IC19.7(P:GND) IC20.3(GND) IC21.3(GND) IC22.7(P:GND) IC23.7(P:GND) IC24.7(P:GND) IC25.7(GND) IC26.7(GND) IC27.7(GND) IC28.7(GND) IC29.10(GND) IC30.10(GND) IC31.8(GND) IC32.8(GND) IC33.10(GND) IC34.10(GND) IC35.10(GND) IC36.10(GND)
VCC: IC1.52(VCC) IC2.52(VCC) IC3.52(VCC) IC4.52(VCC) IC10.14(P:VCC) IC11.14(P:VCC) IC12.14(VCC) IC13.14(VCC) IC14.14(VCC) IC15.14(VCC) IC19.14(P:VCC) IC20.5(VCC) IC21.5(VCC) IC22.14(P:VCC) IC23.14(P:VCC) IC24.14(P:VCC) IC25.14(VCC) IC26.14(VCC) IC27.14(VCC) IC28.14(VCC) IC29.20(VCC) IC30.20(VCC) IC31.16(VCC) IC32.16(VCC) IC33.20(VCC) IC34.20(VCC) IC35.20(VCC) IC36.20(VCC)

## Library data of the parts
10MHZ TP1-TP5 = testpad:PTR1: TEST PIN
#LD_VRAM #S0 #S1-#S3 = jumper:SJ: SMD solder JUMPER
ADDR = pinhead_bottom:PINHD-2X7: PIN HEADER
ADDR_ = pinhead:PINHD-2X7: PIN HEADER
C1-C30 = rcl:C-EU: CAPACITOR, European symbol; SPICEPREFIX: C
C31 = BeagleBone_Blue_R3:CAPACITOR-P: POLARIZED CAPACITOR, American symbol
I/O MBUS1 = pinhead:PINHD-2X16: PIN HEADER
IC1-IC4 = memory-idt:71321L: MEMORY; OC_FARNELL: unknown; OC_NEWARK: unknown
IC5-IC7 IC16-IC18 = 40xx:4161: Synchronous presettable 4-bit binary COUNTER
IC8 IC9 = MyLibrary_9_2_2:4067: 16-channel ANALOG MULTIPLEXER
IC10 IC11 IC22 IC24 = AAA__74xx-eu:74*04: Hex INVERTER
IC12-IC15 IC25-IC28 = AAA__74xx-eu:74*30: 8-input NAND gate
IC19 IC23 = AAA__74xx-eu:74*00: Quad 2-input NAND gate
IC20 = 74xx-little-de:74*1G125: Single Bus Buffer Gate with 3-State Output
IC21 = 74xx-little-de:74*1G00: 2-input NAND gate
IC29 IC30 IC33 IC34 = AAA__74xx-eu:74*574: 8-bit D type FLIP FLOP bus driver
IC31 IC32 = 74xx-eu:74*138: 3-line to 8-line DECODER/DEMULTIPLEXER
IC35 IC36 = AAA__74xx-eu:74*245: Octal BUS TRANSCEIVER, 3-state
JP2 = pinhead:PINHD-1X11: PIN HEADER
JP4 = pinhead_bottom:PINHD-1X11: PIN HEADER
MBUS = pinhead_bottom:PINHD-2X16: PIN HEADER
OS1 = IQD-Frequency-Products:OSC-OE: OSCILLATOR WITH OE
PWR = pinhead_bottom:PINHD-2X4: PIN HEADER
PWR1 = pinhead:PINHD-2X4: PIN HEADER
R1-R11 = rcl:R-EU_: RESISTOR, European symbol; SPICEPREFIX: R
SJ1 = jumper:SJ2W: SMD solder JUMPER
U1 = 74LV:SN74LVC1G157: SINGLE 2-INPUT MULTIPLEXER
U$1 = MyLibrary_9_2_2:OPS-S5621YG
VGA = pinhead:PINHD-2X5: PIN HEADER